# Altium schematic sheet Sheet_Symbol_Circuit.SchDoc
size A4; DocumentNumber: 1; SheetNumber: 1
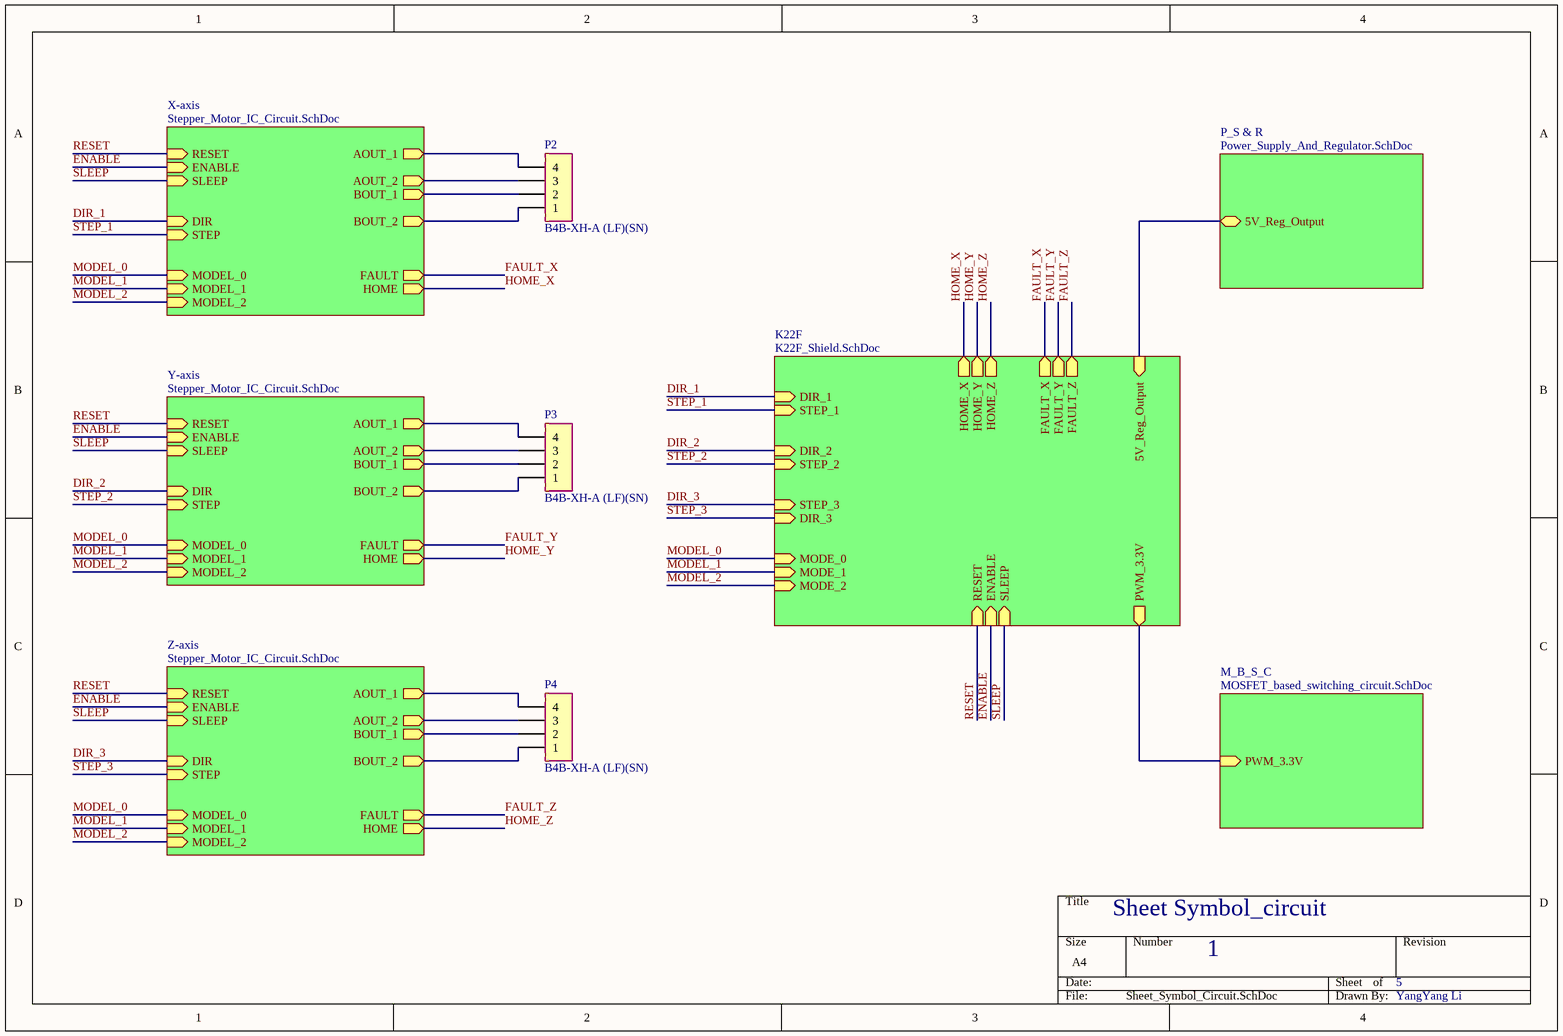
[diagram p0: Sheet_Symbol_Circuit.SchDoc]

## Parts
P2  B4B-XH-A (LF)(SN)  [B4B-XH-A (LF)(SN)]
P3  B4B-XH-A (LF)(SN)  [B4B-XH-A (LF)(SN)]
P4  B4B-XH-A (LF)(SN)  [B4B-XH-A (LF)(SN)]

## Sub-sheets
K22F = K22F_Shield.SchDoc: MODE_2 (in), MODE_0 (in), MODE_1 (in), SLEEP (in), ENABLE (in), RESET (in), PWM_3.3V (out), DIR_1 (in), STEP_1 (in), DIR_2 (in), STEP_2 (in), STEP_3 (in), DIR_3 (in), HOME_Y (out), HOME_Z (out), HOME_X (out), 5V_Reg_Output (in), FAULT_Y (out), FAULT_X (out), FAULT_Z (out)
M_B_S_C = MOSFET_based_switching_circuit.SchDoc: PWM_3.3V (in)
P_S & R = Power_Supply_And_Regulator.SchDoc: 5V_Reg_Output (bidir)
X-axis = Stepper_Motor_IC_Circuit.SchDoc: AOUT_1 (out), AOUT_2 (out), BOUT_1 (out), BOUT_2 (out), DIR (in), STEP (in), MODEL_0 (in), MODEL_1 (in), MODEL_2 (in), RESET (in), ENABLE (in), SLEEP (in), FAULT (out), HOME (out)
Y-axis = Stepper_Motor_IC_Circuit.SchDoc: AOUT_1 (out), AOUT_2 (out), BOUT_1 (out), BOUT_2 (out), DIR (in), STEP (in), MODEL_0 (in), MODEL_1 (in), MODEL_2 (in), RESET (in), ENABLE (in), SLEEP (in), FAULT (out), HOME (out)
Z-axis = Stepper_Motor_IC_Circuit.SchDoc: AOUT_1 (out), AOUT_2 (out), BOUT_1 (out), BOUT_2 (out), DIR (in), STEP (in), MODEL_0 (in), MODEL_1 (in), MODEL_2 (in), RESET (in), ENABLE (in), SLEEP (in), HOME (out), FAULT (out)

## Nets
DIR_1: sheet X-axis/DIR, sheet K22F/DIR_1
DIR_2: sheet Y-axis/DIR, sheet K22F/DIR_2
DIR_3: sheet Z-axis/DIR, sheet K22F/STEP_3
ENABLE: sheet X-axis/ENABLE, sheet Y-axis/ENABLE, sheet Z-axis/ENABLE, sheet K22F/ENABLE
FAULT_X: sheet X-axis/FAULT, sheet K22F/FAULT_X
FAULT_Y: sheet Y-axis/FAULT, sheet K22F/FAULT_Y
FAULT_Z: sheet Z-axis/FAULT, sheet K22F/FAULT_Z
HOME_X: sheet X-axis/HOME, sheet K22F/HOME_X
HOME_Y: sheet Y-axis/HOME, sheet K22F/HOME_Y
HOME_Z: sheet Z-axis/HOME, sheet K22F/HOME_Z
MODEL_0: sheet X-axis/MODEL_0, sheet Y-axis/MODEL_0, sheet Z-axis/MODEL_0, sheet K22F/MODE_0
MODEL_1: sheet X-axis/MODEL_1, sheet Y-axis/MODEL_1, sheet Z-axis/MODEL_1, sheet K22F/MODE_1
MODEL_2: sheet X-axis/MODEL_2, sheet Y-axis/MODEL_2, sheet Z-axis/MODEL_2, sheet K22F/MODE_2
RESET: sheet X-axis/RESET, sheet Y-axis/RESET, sheet Z-axis/RESET, sheet K22F/RESET
SLEEP: sheet X-axis/SLEEP, sheet Y-axis/SLEEP, sheet Z-axis/SLEEP, sheet K22F/SLEEP
STEP_1: sheet X-axis/STEP, sheet K22F/STEP_1
STEP_2: sheet Y-axis/STEP, sheet K22F/STEP_2
STEP_3: sheet Z-axis/STEP, sheet K22F/DIR_3
NetP2_1: P2.1 ; sheet X-axis/BOUT_2
NetP2_2: P2.2 ; sheet X-axis/BOUT_1
NetP2_3: P2.3 ; sheet X-axis/AOUT_2
NetP2_4: P2.4 ; sheet X-axis/AOUT_1
NetP3_1: P3.1 ; sheet Y-axis/BOUT_2
NetP3_2: P3.2 ; sheet Y-axis/BOUT_1
NetP3_3: P3.3 ; sheet Y-axis/AOUT_2
NetP3_4: P3.4 ; sheet Y-axis/AOUT_1
NetP4_1: P4.1 ; sheet Z-axis/BOUT_2
NetP4_2: P4.2 ; sheet Z-axis/BOUT_1
NetP4_3: P4.3 ; sheet Z-axis/AOUT_2
NetP4_4: P4.4 ; sheet Z-axis/AOUT_1
(unnamed): sheet K22F/PWM_3.3V, sheet M_B_S_C/PWM_3.3V
(unnamed): sheet K22F/5V_Reg_Output, sheet P_S & R/5V_Reg_Output

## Notes on the sheet
- Sheet Symbol_circuit
- 1
- 5
- YangYang Li

## Library data of the parts
P2-P4 = B4B-XH-A (LF)(SN) Wire-to-board connector: Wire-to-board connector, vertical, 2.5mm, 4 contacts